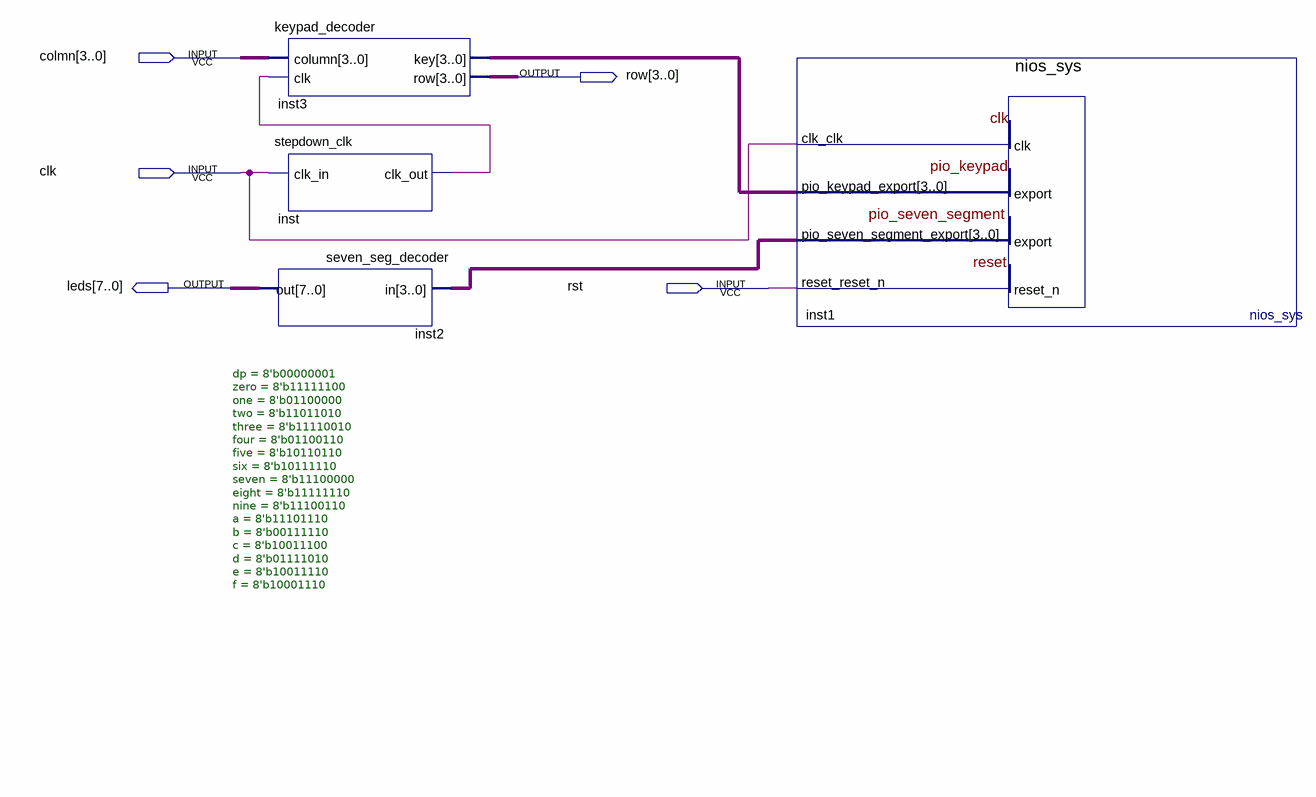
[diagram p0: schematic sheet]
// Quartus schematic seven_segment_keypad.bdf as structural Verilog: 4 symbols, 5 pins
module seven_segment_keypad (
  input  [3:0] colmn,
  input  clk,
  input  rst,
  output [3:0] row,
  output [7:0] leds
);

  wire inst_clk_out;
  wire [3:0] inst1_pio_seven_segment_export, inst3_key;

  keypad_decoder inst3 (.column(colmn), .clk(inst_clk_out), .key(inst3_key), .row(row));
  stepdown_clk inst (.clk_in(clk), .clk_out(inst_clk_out));
  seven_seg_decoder #(.dp(8'b00000001), .zero(8'b11111100), .one(8'b01100000), .two(8'b11011010), .three(8'b11110010), .four(8'b01100110), .five(8'b10110110), .six(8'b10111110), .seven(8'b11100000), .eight(8'b11111110), .nine(8'b11100110), .a(8'b11101110), .b(8'b00111110), .c(8'b10011100), .d(8'b01111010), .e(8'b10011110), .f(8'b10001110)) inst2 (
    .in(inst1_pio_seven_segment_export), .out(leds));
  nios_sys inst1 (
    .clk_clk(clk), .pio_keypad_export(inst3_key), .reset_reset_n(rst),
    .pio_seven_segment_export(inst1_pio_seven_segment_export));
endmodule
